# EAGLE design Power:Logic Board2 (EAGLE 7.6.0)
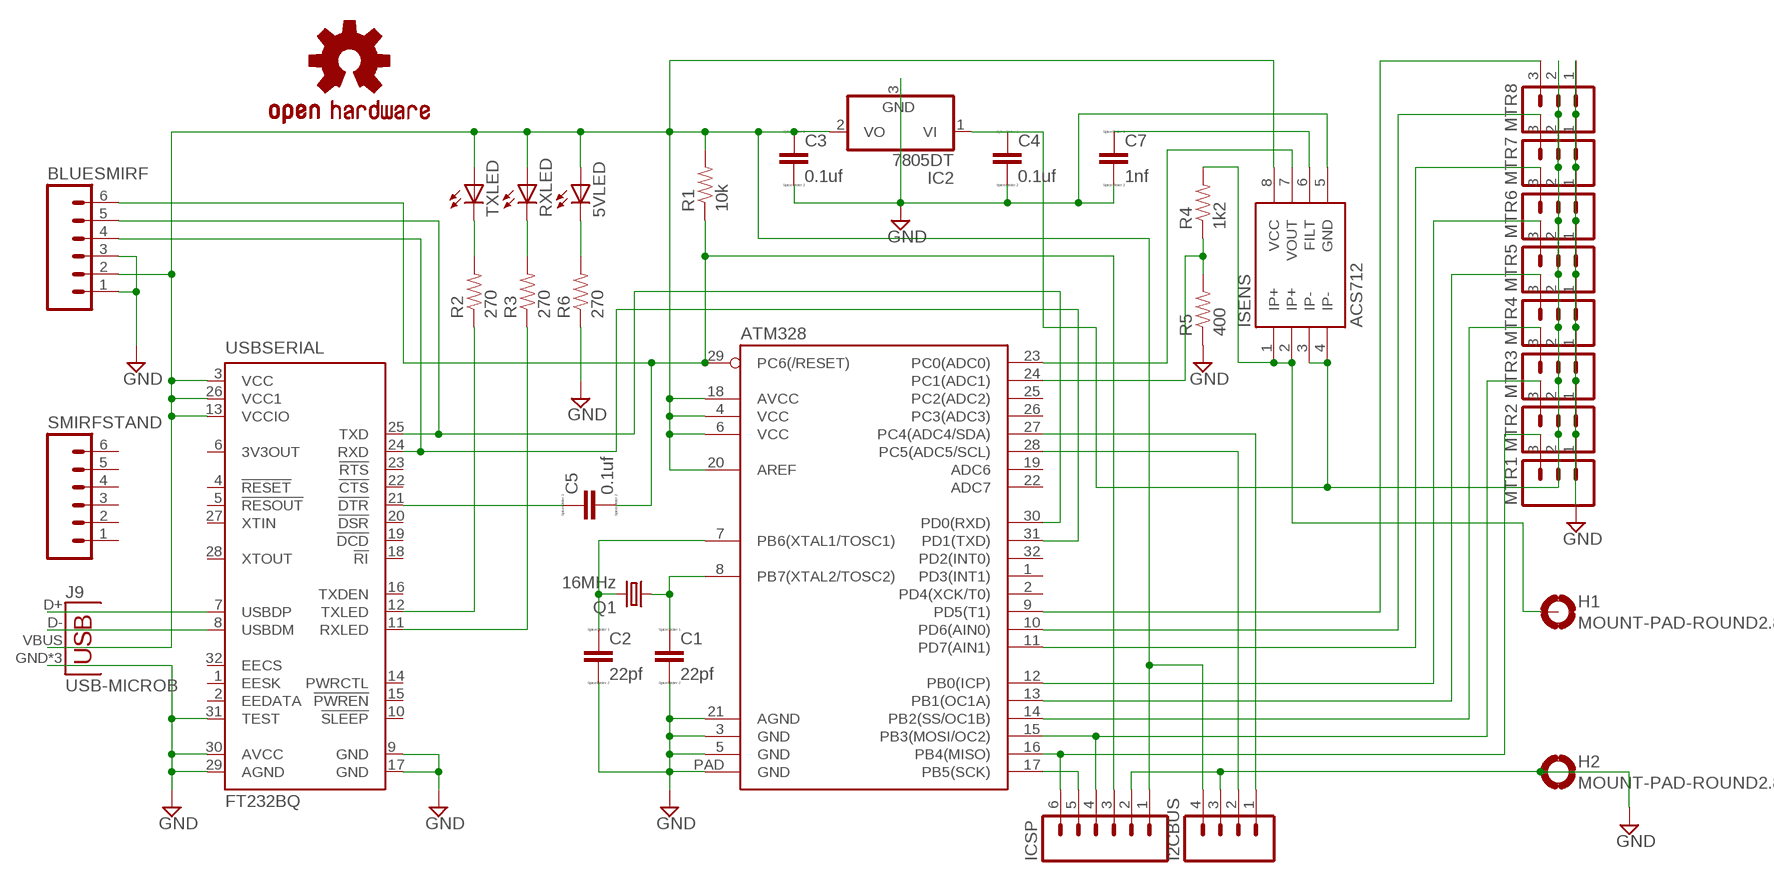
[diagram p0: schematic, sheet 1]

## Parts
5VLED  LEDCHIPLED_0805  [CHIPLED_0805]
ATM328  ATMEGA328P_MLFMLF32  [MLF32-PAD]
BLUESMIRF  M06NO_SILK_YES_STOP  [1X06_NO_SILK_YES_STOP]
C1  22pf  C  [C0805]
C2  22pf  C  [C0805]
C3  0.1uf  C  [C0805]
C4  0.1uf  C  [C0805]
C5  0.1uf  C  [C0805]
C7  1nf  C  [C0805]
H1  MOUNT-PAD-ROUND2.8  [2,8-PAD]
H2  MOUNT-PAD-ROUND2.8  [2,8-PAD]
I2CBUS  M04NO_SILK_ALL_ROUND  [1X04_NO_SILK_ALL_ROUND]
IC2  7805DT  [TO252]
ICSP  M06NO_SILK_YES_STOP  [1X06_NO_SILK_YES_STOP]
ISENS  ACS712  [SO08]
J9  USB-MICROB  [USB-MICROB]
LOGO1  OSHW-LOGOM  [OSHW-LOGO-M]
MTR1  M03PTH  [1X03]
MTR2  M03PTH  [1X03]
MTR3  M03PTH  [1X03]
MTR4  M03PTH  [1X03]
MTR5  M03PTH  [1X03]
MTR6  M03PTH  [1X03]
MTR7  M03PTH  [1X03]
MTR8  M03PTH  [1X03]
Q1  16MHz  CRYSTALHC49U-V  [HC49U-V]
R1  10k  RESISTOR0805-RES  [0805]
R2  270  RESISTOR0805-RES  [0805]
R3  270  RESISTOR0805-RES  [0805]
R4  1k2  RESISTOR0805-RES  [0805]
R5  400  RESISTOR0805-RES  [0805]
R6  270  RESISTOR0805-RES  [0805]
RXLED  LEDCHIPLED_0805  [CHIPLED_0805]
SMIRFSTAND  M06NO_SILK_YES_STOP  [1X06_NO_SILK_YES_STOP]
TXLED  LEDCHIPLED_0805  [CHIPLED_0805]
USBSERIAL  FT232BQ  [QFN32]

## Nets
GND: ATM328.3(GND) ATM328.5(GND) ATM328.21(AGND) ATM328.PAD(GND) BLUESMIRF.1 BLUESMIRF.3 C1.2 C2.2 C3.2 C4.2 C7.2 H2.B2,8(MOUNT) I2CBUS.3 IC2.3(GND) ICSP.2 ISENS.5(GND) J9.GND J9.MT1(GND) J9.MT2(GND) MTR1.1 MTR2.1 MTR3.1 MTR4.1 MTR5.1 MTR6.1 MTR7.1 MTR8.1 R5.1 R6.1 USBSERIAL.9(GND) USBSERIAL.17(GND) USBSERIAL.29(AGND) USBSERIAL.30(AVCC) USBSERIAL.31(TEST)
N$1: J9.D+ USBSERIAL.7(USBDP)
N$2: ATM328.31(PD1(TXD)) BLUESMIRF.4 USBSERIAL.24(RXD)
N$3: J9.D- USBSERIAL.8(USBDM)
N$4: 5VLED.A ATM328.4(VCC) ATM328.6(VCC) ATM328.18(AVCC) ATM328.20(AREF) BLUESMIRF.2 C3.1 I2CBUS.4 IC2.2(VO) ICSP.1 ISENS.8(VCC) J9.VBUS R1.2 RXLED.A TXLED.A USBSERIAL.3(VCC) USBSERIAL.13(VCCIO) USBSERIAL.26(VCC1)
N$5: ATM328.14(PB2(SS/OC1B)) MTR3.3
N$6: ATM328.23(PC0(ADC0)) ISENS.7(VOUT)
N$7: ATM328.8(PB7(XTAL2/TOSC2)) C1.1 Q1.1
N$8: ATM328.9(PD5(T1)) MTR8.3
N$9: ATM328.13(PB1(OC1A)) MTR4.3
N$10: ATM328.17(PB5(SCK)) ICSP.5
N$11: ATM328.12(PB0(ICP)) MTR5.3
N$12: ATM328.16(PB4(MISO)) ICSP.6 MTR1.3
N$13: ATM328.15(PB3(MOSI/OC2)) ICSP.4 MTR2.3
N$14: R2.2 TXLED.C
N$15: ATM328.7(PB6(XTAL1/TOSC1)) C2.1 Q1.2
N$16: R2.1 USBSERIAL.12(TXLED)
N$17: R3.2 RXLED.C
N$18: R3.1 USBSERIAL.11(RXLED)
N$19: ATM328.11(PD7(AIN1)) MTR6.3
N$20: ATM328.29(PC6(/RESET)) BLUESMIRF.6 C5.2 ICSP.3 R1.1
N$21: C7.1 ISENS.6(FILT)
N$22: C4.1 IC2.1(VI) ISENS.3(IP-) ISENS.4(IP-) MTR1.2 MTR2.2 MTR3.2 MTR4.2 MTR5.2 MTR6.2 MTR7.2 MTR8.2
N$23: ATM328.24(PC1(ADC1)) R4.1 R5.2
N$24: ATM328.10(PD6(AIN0)) MTR7.3
N$25: H1.B2,8(MOUNT) ISENS.1(IP+) ISENS.2(IP+) R4.2
N$26: ATM328.30(PD0(RXD)) BLUESMIRF.5 USBSERIAL.25(TXD)
N$27: C5.1 USBSERIAL.21(!DTR)
N$28: ATM328.28(PC5(ADC5/SCL)) I2CBUS.2
N$29: ATM328.27(PC4(ADC4/SDA)) I2CBUS.1
N$30: 5VLED.C R6.2
Unconnected: ATM328.1(PD3(INT1)) ATM328.2(PD4(XCK/T0)) ATM328.19(ADC6) ATM328.22(ADC7) ATM328.25(PC2(ADC2)) ATM328.26(PC3(ADC3)) ATM328.32(PD2(INT0)) SMIRFSTAND.1 SMIRFSTAND.2 SMIRFSTAND.3 SMIRFSTAND.4 SMIRFSTAND.5 SMIRFSTAND.6 USBSERIAL.1(EESK) USBSERIAL.2(EEDATA) USBSERIAL.4(!RESET) USBSERIAL.5(!RESOUT) USBSERIAL.6(3V3OUT) USBSERIAL.10(!SLEEP) USBSERIAL.14(PWRCTL) USBSERIAL.15(!PWREN) USBSERIAL.16(TXDEN) USBSERIAL.18(!RI) USBSERIAL.19(!DCD) USBSERIAL.20(!DSR) USBSERIAL.22(!CTS) USBSERIAL.23(!RTS) USBSERIAL.27(XTIN) USBSERIAL.28(XTOUT) USBSERIAL.32(EECS)

## Library data of the parts
5VLED RXLED TXLED = led:LED: LED OSRAM: - CHIPLED LG R971, LG N971, LY N971, LG Q971, LY Q971, LO R971, LY R971 LH N974, LH R974 LS Q976, LO Q976, LY Q976 LO Q996 - Hyper CHIPLED LW Q18S LB Q993, LB Q99A, LB R99A - SideLED LS A670, LO A670, LY A670, LG A670, LP A670 LB A673, LV A673, LT A673, LW A673 LH A674 LY A675 LS A676, LA A676, LO A676, LY A676, LW A676 LS A679, LY A679, LG A679 - Hyper Micro SIDELED® LS Y876, LA Y876, LO Y876, LY Y876 LT Y87S - SmartLED LW L88C, LW L88S LB L89C, LB L89S, LG L890 LS L89K, LO L89K, LY L89K LS L896, LA L896, LO L896, LY L896 - TOPLED LS T670, LO T670, LY T670, LG T670, LP T670 LSG T670, LSP T670, LSY T670, LOP T670, LYG T670 LG T671, LOG T671, LSG T671 LB T673, LV T673, LT T673, LW T673 LH T674 LS T676, LA T676, LO T676, LY T676, LB T676, LH T676, LSB T676, LW T676 LB T67C, LV T67C, LT T67C, LS T67K, LO T67K, LY T67K, LW E67C LS E67B, LA E67B, LO E67B, LY E67B, LB E67C, LV E67C, LT E67C LW T67C LS T679, LY T679, LG T679 LS T770, LO T770, LY T770, LG T770, LP T770 LB T773, LV T773, LT T773, LW T773 LH T774 LS E675, LA E675, LY E675, LS T675 LS T776, LA T776, LO T776, LY T776, LB T776 LHGB T686 LT T68C, LB T68C - Hyper Mini TOPLED® LB M676 - Mini TOPLED Santana® LG M470 LS M47K, LO M47K, LY M47K Source: http://www.osram.convergy.de LUXEON: - LUMILED® LXK2-PW12-R00, LXK2-PW12-S00, LXK2-PW14-U00, LXK2-PW14-V00 LXK2-PM12-R00, LXK2-PM12-S00, LXK2-PM14-U00 LXK2-PE12-Q00, LXK2-PE12-R00, LXK2-PE12-S00, LXK2-PE14-T00, LXK2-PE14-U00 LXK2-PB12-K00, LXK2-PB12-L00, LXK2-PB12-M00, LXK2-PB14-N00, LXK2-PB14-P00, LXK2-PB14-Q00 LXK2-PR12-L00, LXK2-PR12-M00, LXK2-PR14-Q00, LXK2-PR14-R00 LXK2-PD12-Q00, LXK2-PD12-R00, LXK2-PD12-S00 LXK2-PH12-R00, LXK2-PH12-S00 LXK2-PL12-P00, LXK2-PL12-Q00, LXK2-PL12-R00 Source: www.luxeon.com KINGBRIGHT: KA-3528ASYC Source: www.kingbright.com
ATM328 = SparkFun-DigitalIC:ATMEGA328P_MLF: 32-Pin Atmega328 part Commonly used on Arduino compatible boards Available in QFP and QFN packages TQFP is IC-09069 QFN is non-stock
BLUESMIRF ICSP SMIRFSTAND = SparkFun-Connectors:M06: Header 6 Standard 6-pin 0.1" header. Use with straight break away headers (SKU : PRT-00116), right angle break away headers (PRT-00553), swiss pins (PRT-00743), machine pins (PRT-00117), and female headers (PRT-00115). Molex polarized connector foot print use with SKU : PRT-08094 with associated crimp pins and housings. NOTES ON THE VARIANTS LOCK and LOCK_LONGPADS... This footprint was designed to help hold the alignment of a through-hole component (i.e. 6-pin header) while soldering it into place. You may notice that each hole has been shifted either up or down by 0.005 of an inch from it's more standard position (which is a perfectly straight line). This slight alteration caused the pins (the squares in the middle) to touch the edges of the holes. Because they are alternating, it causes a "brace" to hold the component in place. 0.005 has proven to be the perfect amount of "off-center" position when using our standard breakaway headers. Although looks a little odd when you look at the bare footprint, once you have a header in there, the alteration is very hard to notice. Also,if you push a header all the way into place, it is covered up entirely on the bottom side. This idea of altering the position of holes to aid alignment will be further integrated into the Sparkfun Library for other footprints. It can help hold any component with 3 or more connection pins.
C1-C5 C7 = eagle-ltspice:C: CAPACITOR, European symbol; SPICEMODEL: NONE; SPICEPREFIX: C
H1 H2 = holes:MOUNT-PAD-ROUND: MOUNTING PAD, round
I2CBUS = SparkFun-Connectors:M04: Header 4 Standard 4-pin 0.1" header. Use with straight break away headers (SKU : PRT-00116), right angle break away headers (PRT-00553), swiss pins (PRT-00743), machine pins (PRT-00117), and female headers (PRT-00115). Molex polarized connector foot print use with SKU : PRT-08231 with associated crimp pins and housings. 1MM SMD Version SKU: PRT-10208; PROD_ID: CONN-09696
IC2 = linear:78*: Positive VOLTAGE REGULATOR Source: http://cache.national.com/ds/LM/LM78L05.pdf http://www.fairchildsemi.com/ds/LM/LM7805.pdf
ISENS = SparkFun-AnalogIC:ACS712: Hall-effect-based isolated linear current sensor; PROD_ID: IC-08964
J9 = SparkFun-Connectors:USB: USB Connectors USB-B-PTH is fully proven SKU : PRT-00139/CONN-08278 USB-miniB is fully proven SKU : PRT-00587 USB-A-PCB is untested. USB-A-H is throughly reviewed, but untested. Spark Fun Electronics SKU : PRT-00437 USB-B-SMT is throughly reviewed, but untested. Needs silkscreen touching up. USB-A-S has not been used/tested USB-MB-H has not been used/tested USB-MICROB has been used. CONN-09505; PROD_ID: CONN-09505
LOGO1 = SparkFun-Aesthetics:OSHW-LOGO: Open Source Hardware Logo This logo indicates the piece of hardware it is found on incorporates a OSHW license and/or adheres to the definition of open source hardware found here: http://freedomdefined.org/OSHW
MTR1-MTR8 = SparkFun-Connectors:M03: Header 3 Standard 3-pin 0.1" header. Use with straight break away headers (SKU : PRT-00116), right angle break away headers (PRT-00553), swiss pins (PRT-00743), machine pins (PRT-00117), and female headers (PRT-00115). Molex polarized connector foot print use with SKU : PRT-08232 with associated crimp pins and housings.
Q1 = crystal:CRYSTAL: CRYSTAL; OC_FARNELL: 1666969; OC_NEWARK: unknown
R1-R6 = SparkFun-Passives:RESISTOR: Resistor Basic schematic elements and footprints for 0603, 1206, and PTH resistors.
USBSERIAL = ftdichip:FT232B: USB to serial UART interface Source: DS_FT232BL_BQ.pdf; OC_FARNELL: unknown; OC_NEWARK: unknown

## Board
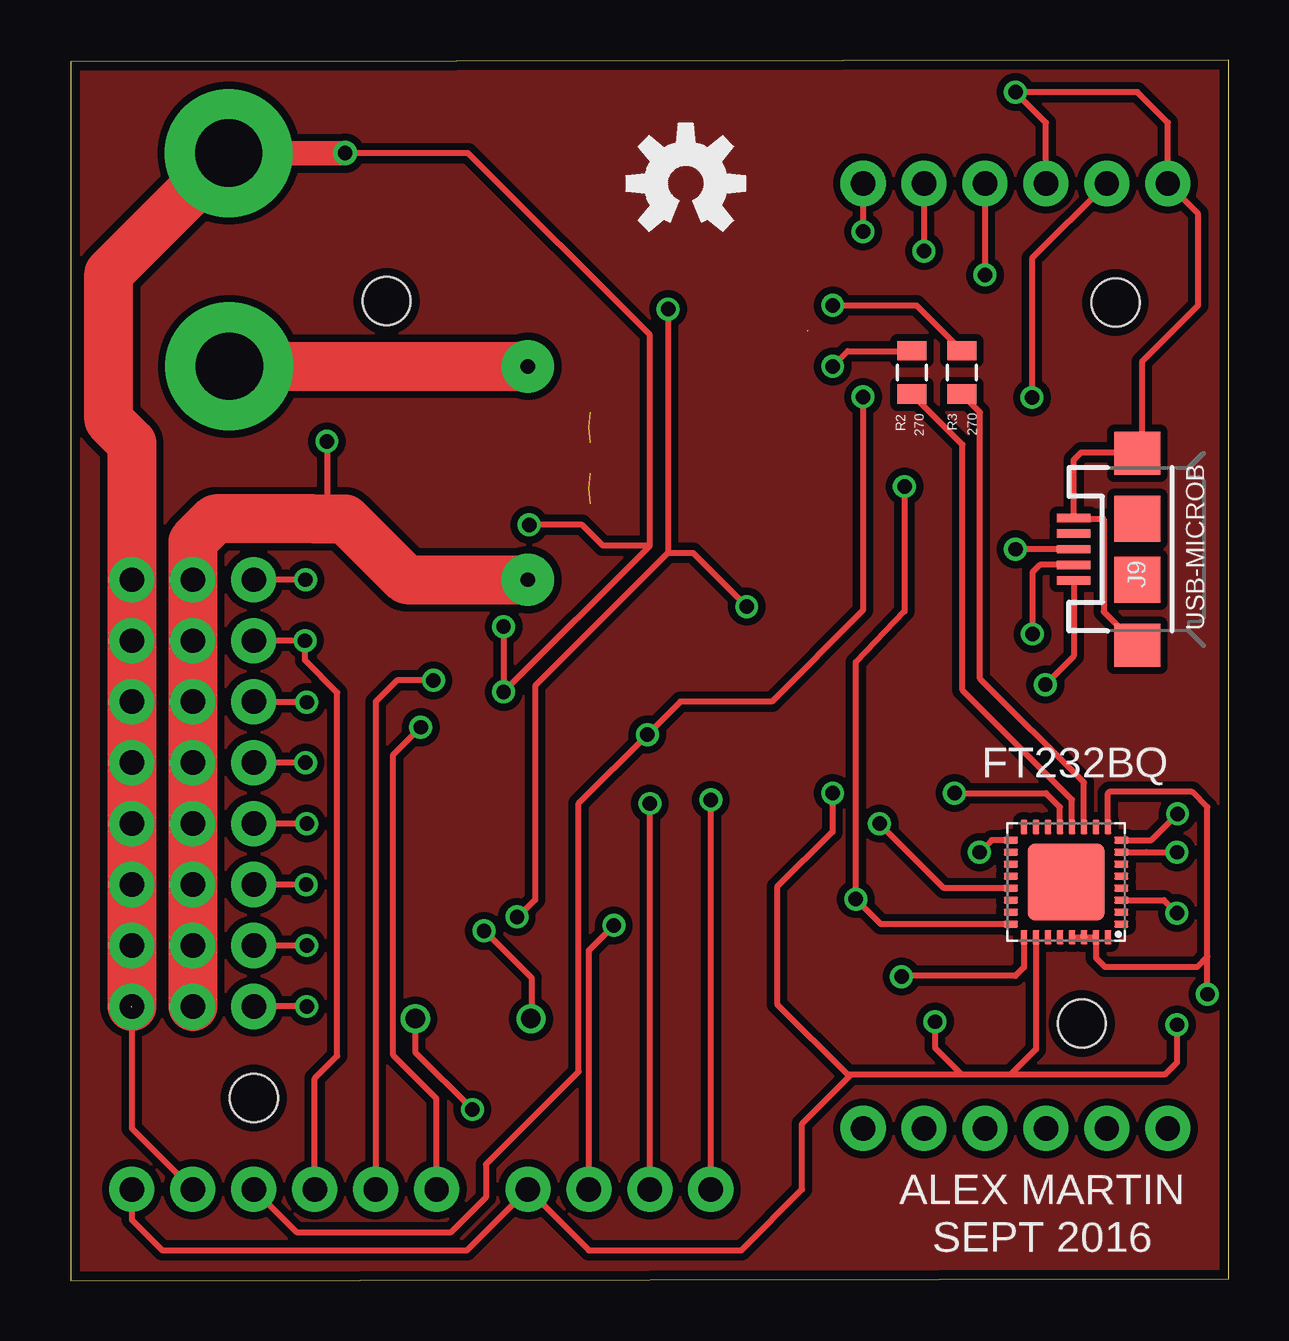
[diagram p1: board, top side]
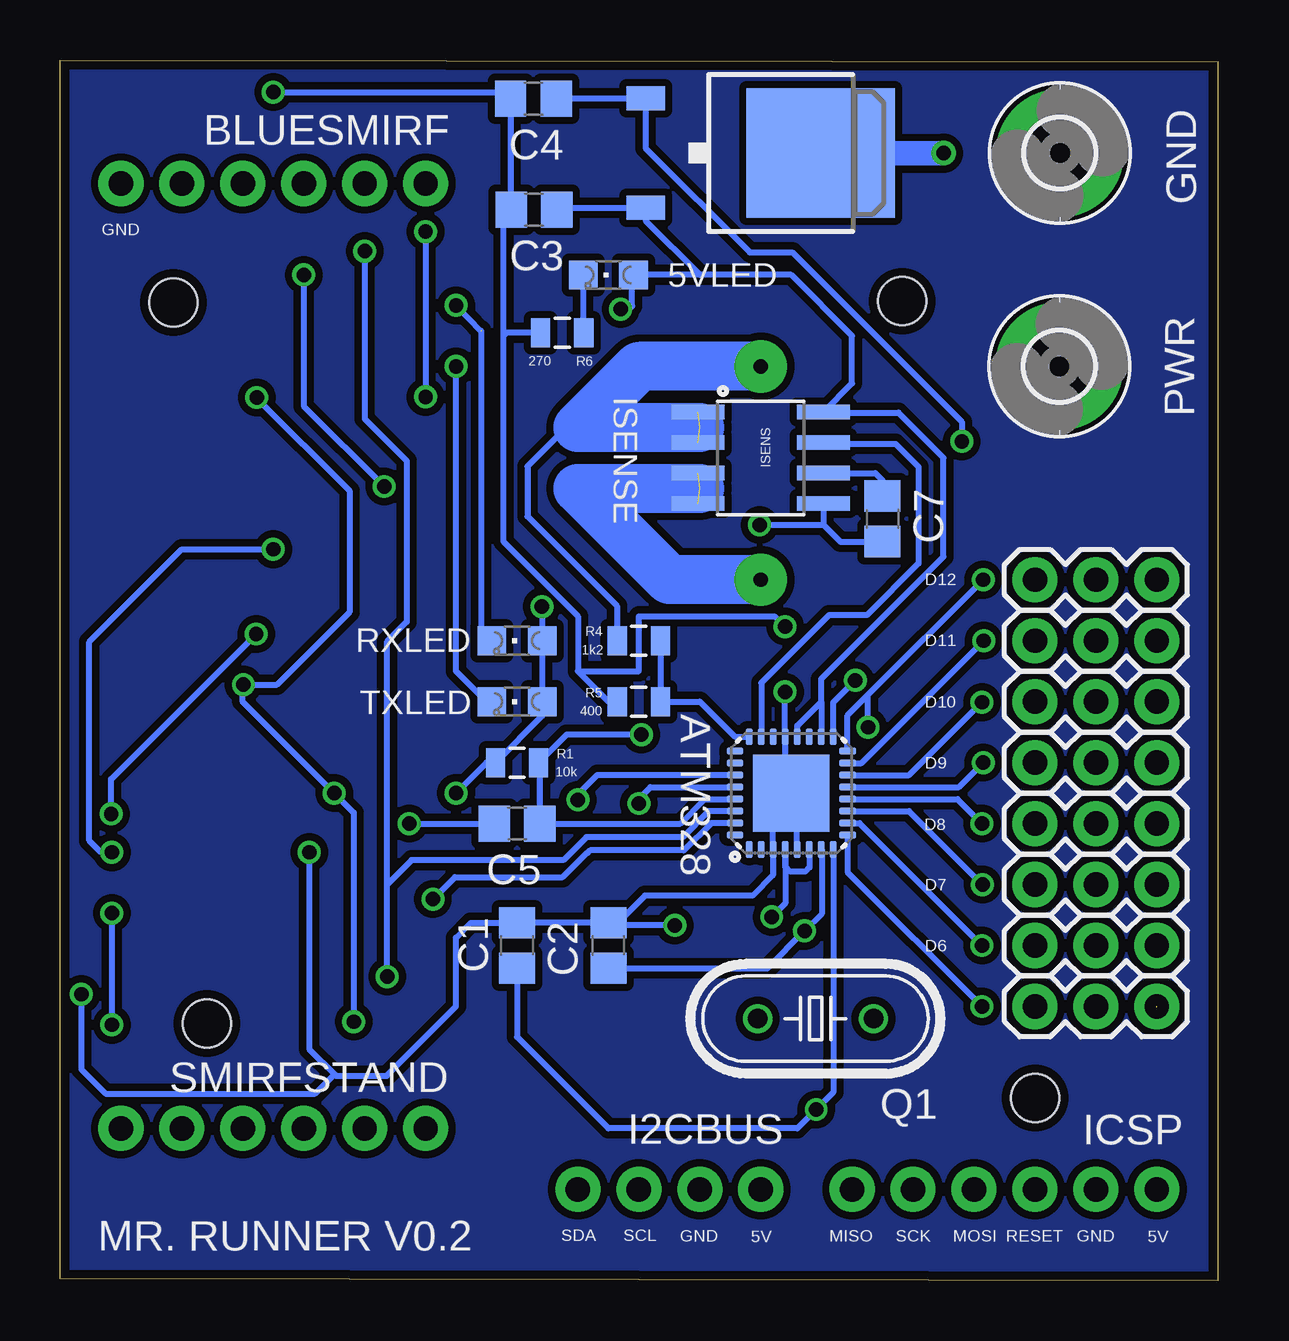
[diagram p2: board, bottom side, seen from below]

Size 48.26 x 50.87 mm. Coordinates in mm from the lower left corner, seen from the top.
Outline: 0,0 48.26,0.08 48.26,50.87 0,50.79 0,0
Copper layers (1*16): Top 0.0356mm / dielectric 1.5011mm / Bottom 0.0356mm
Design rules "oshpark-2layer": minimum track width 6mil, minimum drill 13mil, track to track 6mil, track to pad 6mil, pad to pad 6mil, via to via 6mil, smd to smd 6mil, copper to edge 15mil, drill to drill 6mil, minimum pad ring 7mil, minimum via ring 7mil, stop-mask expansion 2.5mil, vias tented up to drill 0mil, thermal gap 10mil
Holes 2 mm at 43.54,40.77 42.14,10.72 7.62,7.62 13.16,40.82

### Footprints (pad centres in the part's own frame; a part is rotated, then mirrored left to right if it is on the bottom)
CHIPLED_0805 = smd 1.2 x 1.2: A 0,-1.05; C 0,1.05
MLF32-PAD = smd 0.7 x 0.3: 1 -2.35,1.75; 2 -2.35,1.25; 3 -2.35,0.75; 4 -2.35,0.25; 5 -2.35,-0.25; 6 -2.35,-0.75; 7 -2.35,-1.25; 8 -2.35,-1.75; 17 2.35,-1.75; 18 2.35,-1.25; 19 2.35,-0.75; 20 2.35,-0.25; 21 2.35,0.25; 22 2.35,0.75; 23 2.35,1.25; 24 2.35,1.75 | smd 0.3 x 0.7: 9 -1.75,-2.35; 10 -1.25,-2.35; 11 -0.75,-2.35; 12 -0.25,-2.35; 13 0.25,-2.35; 14 0.75,-2.35; 15 1.25,-2.35; 16 1.75,-2.35; 25 1.75,2.35; 26 1.25,2.35; 27 0.75,2.35; 28 0.25,2.35; 29 -0.25,2.35; 30 -0.75,2.35; 31 -1.25,2.35; 32 -1.75,2.35 | smd 3.2 x 3.2: PAD 0,0
1X06_NO_SILK_YES_STOP = drill 1.016 pad 1.88: 1 0,0; 2 2.54,0; 3 5.08,0; 4 7.62,0; 5 10.16,0; 6 12.7,0
C0805 = smd 1.3 x 1.5: 1 -0.95,0; 2 0.95,0
2,8-PAD = drill 2.8 pad 5.334: B2,8 0,0
1X04_NO_SILK_ALL_ROUND = drill 1.016 pad 1.88: 1 0,0; 2 2.54,0; 3 5.08,0; 4 7.62,0
TO252 = smd 1 x 1.6: 1 -2.28,-4.8; 2 2.28,-4.8 | smd 5.4 x 6.2: 3 0,2.5
SO08 = smd 0.61 x 2.21: 1 -1.905,-2.616; 2 -0.635,-2.616; 3 0.635,-2.616; 4 1.905,-2.616; 5 1.905,2.616; 6 0.635,2.616; 7 -0.635,2.616; 8 -1.905,2.616
USB-MICROB = smd 0.35 x 1.4: D+ 0,2.65; D- -0.65,2.65; GND 1.3,2.65; ID 0.65,2.65; VBUS -1.3,2.65 | smd 1.8 x 1.9: MT1 -4,0; MT2 4,0 | smd 1.9 x 1.9: P$1 -1.27,0; P$2 1.27,0
1X03 = drill 1.016 pad 1.88: 1 0,0; 2 2.54,0; 3 5.08,0
HC49U-V = drill 0.813: 1 -2.413,0; 2 2.413,0
0805 = smd 0.8 x 1.2: 1 -0.9,0; 2 0.9,0
QFN32 = smd 0.6 x 0.3: 1 -2.3,1.75; 2 -2.3,1.25; 3 -2.3,0.75; 4 -2.3,0.25; 5 -2.3,-0.25; 6 -2.3,-0.75; 7 -2.3,-1.25; 8 -2.3,-1.75; 17 2.3,-1.75; 18 2.3,-1.25; 19 2.3,-0.75; 20 2.3,-0.25; 21 2.3,0.25; 22 2.3,0.75; 23 2.3,1.25; 24 2.3,1.75 | smd 0.3 x 0.6: 9 -1.75,-2.3; 10 -1.25,-2.3; 11 -0.75,-2.3; 12 -0.25,-2.3; 13 0.25,-2.3; 14 0.75,-2.3; 15 1.25,-2.3; 16 1.75,-2.3; 25 1.75,2.3; 26 1.25,2.3; 27 0.75,2.3; 28 0.25,2.3; 29 -0.25,2.3; 30 -0.75,2.3; 31 -1.25,2.3; 32 -1.75,2.3 | smd 3.2 x 3.2: EXP 0,0

### Placement (x,y rotation side)
5VLED  25.4,41.91 90 bottom
ATM328  17.78,20.32 90 bottom
BLUESMIRF  45.72,45.72 180 top
C1  29.21,13.97 90 bottom
C2  25.4,13.97 90 bottom
C3  28.5,44.63 180 bottom
C4  28.52,49.25 180 bottom
C5  29.21,19.05 0 bottom
C7  13.97,31.75 270 bottom
H1  6.6,38.1 0 bottom
H2  6.58,46.99 0 bottom
I2CBUS  26.67,3.81 180 top
IC2  19.05,46.99 270 bottom
ICSP  2.54,3.81 0 top
ISENS  19.05,34.29 270 bottom
J9  44.45,30.48 90 top
LOGO1  25.63,45.72 0 top
MTR1  2.54,29.21 180 bottom
MTR2  2.54,26.67 180 bottom
MTR3  2.54,24.13 180 bottom
MTR4  2.54,21.59 180 bottom
MTR5  2.54,19.05 180 bottom
MTR6  2.54,16.51 180 bottom
MTR7  2.54,13.97 180 bottom
MTR8  2.54,11.43 180 bottom
Q1  16.76,10.92 180 bottom
R1  29.21,21.59 180 bottom
R2  35.05,37.85 90 top
R3  37.13,37.85 90 top
R4  24.13,26.67 180 bottom
R5  24.13,24.13 0 bottom
R6  27.33,39.5 0 bottom
RXLED  29.21,26.67 90 bottom
SMIRFSTAND  33.02,6.35 0 top
TXLED  29.21,24.13 90 bottom
USBSERIAL  41.48,16.61 180 top

### Tracks (layer width: path | path; a pad name or v marks a point on that pad's centre or on a via)
GND  (via drill 0.6, 0.6 pad 1.02)  (1 unrouted)
  Top 0.254: 24.13,30.63 v18.03,24.54 v18.03,27.25 | 24.13,30.63 22.17,30.63 21.31,31.5 v19.1,31.5 | v22.63,14.81 21.59,13.77 I2CBUS.3 | USBSERIAL.9 43.23,20.32 43.28,20.37 46.74,20.37 47.37,19.74 47.37,13.51 | USBSERIAL.29 USBSERIAL.30 USBSERIAL.31 | USBSERIAL.17 38.38,18.36 v37.87,17.86 | USBSERIAL.31 | v11.43,46.99 IC2.3 24.13,39.41 24.13,30.63 | BLUESMIRF.3 40.64,48.26 v39.37,49.53 44.45,49.53 45.72,48.26 BLUESMIRF.1 46.99,44.45 46.99,40.64 44.64,38.29 44.64,34.67 J9.MT2 44.41,34.52 42.11,34.52 41.8,34.21 J9.GND 41.83,31.75 43.03,31.75 43.05,31.72 43.05,27.88 J9.MT1 | ICSP.2 2.54,6.35 2.54,11.4 | v47.37,11.94 47.37,13.51 | USBSERIAL.31 42.73,13.46 43.1,13.08 46.94,13.08 47.37,13.51
  Top 1.016: H2.B2,8 v11.43,46.99
  Top 2.032: MTR8.1 MTR7.1 MTR6.1 MTR5.1 MTR4.1 MTR3.1 MTR2.1 MTR1.1 2.54,34.9 1.57,35.87 1.57,41.99 H2.B2,8
  Bottom 0.254: C2.2 C1.2 31.14,14.91 31.75,14.3 31.75,11.43 34.65,8.53 36.75,8.53 36.82,8.6 | ISENS.5 16.43,31.5 | 16.43,31.5 15.72,30.79 13.98,30.79 C7.2 | ATM328.5 17.55,17.99 17.55,19.05 17.78,19.28 17.78,19.53 | C2.2 25.01,14.92 23.88,16.05 19.38,16.05 18.54,16.89 18.54,17.96 ATM328.3 18.54,17.98 18.54,18.77 17.78,19.53 | v18.03,24.54 ATM328.21 18.03,21.61 18.01,21.59 17.78,21.59 ATM328.PAD 17.78,19.53 | R5.1 25.4,24.13 26.67,25.4 | 29.77,39.37 29.77,30.79 26.67,27.69 26.67,25.4 | 29.77,39.37 29.77,44.31 C3.2 29.47,44.65 C4.2 29.75,49.53 v39.37,49.53 | R6.1 29.64,39.5 29.77,39.37 | v19.1,31.5 16.43,31.5 | v22.63,14.81 25.29,14.81 C2.2 | v37.87,17.86 37.87,9.65 36.82,8.6 | 26.67,25.4 24.13,25.4 24.13,27.69 18.47,27.69 v18.03,27.25 | v47.37,11.94 47.37,8.81 46.35,7.8 37.62,7.8 36.82,8.6
  Bottom 1.016: IC2.3 v11.43,46.99
N$1  (via drill 0.6)
  Top 0.254: USBSERIAL.7 44.83,17.86 v46.1,17.86 | J9.D+ v39.37,30.48
  Bottom 0.254: v46.1,17.86 46.56,17.86 47.04,18.34 47.04,26.62 43.18,30.48 v39.37,30.48
N$2  (via drill 0.6)
  Top 0.254: v34.75,33.1 34.75,27.89 32.72,25.78 v32.72,15.9 33.75,14.86 USBSERIAL.24 | BLUESMIRF.4 v38.1,41.91
  Bottom 0.254: ATM328.31 21.11,19.07 22.25,17.93 26.16,17.93 26.26,17.83 26.29,17.83 27.3,16.81 31.8,16.81 v32.72,15.9 | v38.1,41.91 38.1,36.45 v34.75,33.1
N$3  (via drill 0.6)
  Top 0.254: USBSERIAL.8 45.03,18.36 v46.13,19.46 | J9.D- 40.4,29.83 40.08,29.51 v40.08,26.95
  Bottom 0.254: 40.08,26.92 v40.08,26.95 46.13,20.9 v46.13,19.46
N$4  (via drill 0.6)
  Top 0.254: v18.59,15.16 18.64,15.16 19.36,15.88 19.36,24.79 24.89,30.33 | v31.75,20.32 31.75,18.69 31.73,18.69 29.44,16.41 29.44,11.53 32.38,8.58 32.51,8.58 | USBSERIAL.26 40.23,9.65 39.17,8.58 | 39.17,8.58 37.13,8.58 | 37.13,8.58 32.51,8.58 | v40.62,24.84 41.8,26.03 J9.VBUS | v36.02,10.79 36.02,9.7 37.13,8.58 | v24.89,40.49 24.89,30.33 | 24.89,30.33 25.93,30.33 v28.17,28.09 | USBSERIAL.13 41.23,19.73 40.64,20.32 v36.83,20.32 | ICSP.1 2.54,2.54 3.81,1.27 16.51,1.27 I2CBUS.4 21.59,1.27 27.94,1.27 30.48,3.81 30.48,6.55 32.51,8.58 | BLUESMIRF.2 40.06,42.6 v40.06,36.8 | USBSERIAL.3 45.56,15.86 v46.1,15.32 | v46.1,10.67 46.1,9.09 45.59,8.58 39.17,8.58
  Bottom 0.254: C3.1 27.47,44.71 IC2.2 23.85,44.17 21.59,41.91 | 16.53,24.13 ATM328.18 | ATM328.20 17.53,23.13 16.53,24.13 | ATM328.6 17.02,17.96 17.02,17.22 17.2,17.04 17.83,17.04 18.03,17.24 ATM328.4 18.03,15.73 v18.59,15.16 | v31.75,20.32 30.48,21.59 R1.2 28.16,23.54 TXLED.A RXLED.A v28.17,28.09 | v36.02,10.79 36.02,19.51 v36.83,20.32 40.66,24.15 40.66,24.79 v40.62,24.84 39.22,24.84 36.2,27.86 36.2,32.92 40.06,36.78 v40.06,36.8 | v24.89,40.49 24.54,40.49 24.41,40.62 24.41,41.85 5VLED.A 21.59,41.91 | 21.59,41.91 17.78,41.91 15.24,39.37 15.24,37.39 ISENS.8 16.41,36.17 13.31,36.17 11.43,34.29 11.43,30.18 16.54,25.07 16.54,24.13 16.53,24.13 | v46.1,15.32 v46.1,10.67
N$5  (via drill 0.6)
  Top 0.254: v9.83,24.11 7.64,24.11 MTR3.3
  Bottom 0.254: ATM328.14 12.86,21.07 v9.83,24.11
N$6
  Bottom 0.254: ISENS.7 16.38,34.87 13.44,34.87 12.47,33.91 12.47,29.9 14.63,27.74 16.2,27.74 19.03,24.91 ATM328.23
N$7  (via drill 0.6)
  Top 0.254: Q1.1 14.35,9.52 v16.74,7.14
  Bottom 0.254: C1.1 29.21,10.16 25.4,6.35 17.53,6.35 v16.74,7.14 16.03,7.85 ATM328.8
N$8  (via drill 0.6)
  Top 0.254: v9.83,11.43 MTR8.3
  Bottom 0.254: ATM328.9 15.43,17.03 v9.83,11.43
N$9  (via drill 0.6)
  Top 0.254: v9.78,21.59 MTR4.3
  Bottom 0.254: ATM328.13 10.8,20.57 v9.78,21.59
N$10  (via drill 0.6)
  Top 0.254: v15.11,25.02 13.59,25.02 12.7,24.13 ICSP.5
  Bottom 0.254: ATM328.17 16.03,24.1 v15.11,25.02
N$11  (via drill 0.6)
  Top 0.254: v9.83,19.05 MTR5.3
  Bottom 0.254: ATM328.12 10.85,20.07 v9.83,19.05
N$12  (via drill 0.6)
  Top 0.254: 9.8,29.18 v9.78,29.21 MTR1.3 | v14.58,23.06 13.44,21.92 13.44,9.4 15.24,7.59 ICSP.6
  Bottom 0.254: ATM328.16 15.43,23.56 14.58,24.41 | 14.58,24.41 v9.78,29.21 | v14.58,23.06 14.58,24.41
N$13  (via drill 0.6)
  Top 0.254: MTR2.3 v9.75,26.67 9.75,25.86 11.1,24.51 11.1,9.37 10.16,8.43 ICSP.4
  Bottom 0.254: ATM328.15 14.85,21.57 v9.75,26.67
N$14  (via drill 0.6)
  Top 0.254: v31.75,38.1 32.38,38.73 35.04,38.73 R2.2
  Bottom 0.254: TXLED.C 30.48,24.13 31.75,25.4 v31.75,38.1
N$15  (via drill 0.6)
  Top 0.254: v17.22,14.58 17.25,14.58 19.2,12.62 19.2,10.95 Q1.2
  Bottom 0.254: ATM328.7 16.51,17.95 16.51,15.29 v17.22,14.58 18.78,13.02 C2.1
N$16
  Top 0.254: USBSERIAL.12 41.73,20.04 37.16,24.61 37.16,34.84 R2.1
N$17  (via drill 0.6)  (1 unrouted)
  Top 0.254: v31.75,40.64 35.24,40.64 R3.2
  Bottom 0.254: RXLED.C 30.71,27.12 30.71,39.6 | v31.75,40.64 30.71,39.57
N$18
  Top 0.254: 37.15,36.93 R3.1 37.9,36.18 37.9,25.1 42.23,20.76 USBSERIAL.11
N$19  (via drill 0.6)
  Top 0.254: v9.8,16.51 MTR6.3
  Bottom 0.254: ATM328.11 12.86,19.57 v9.8,16.51
N$20  (via drill 0.6)
  Top 0.254: v33.02,36.83 33.02,27.94 29.21,24.13 25.4,24.13 v24.03,22.76 21.16,19.89 21.16,8.71 17.3,4.85 17.3,3.48 15.85,2.03 9.4,2.03 ICSP.3 | BLUESMIRF.6 v33.02,43.71
  Bottom 0.254: ATM328.29 21.39,20.07 22.4,19.05 C5.2 28.26,21.54 R1.1 27.14,22.76 v24.03,22.76 | v33.02,43.71 v33.02,36.83
N$21
  Bottom 0.254: ISENS.6 14.28,33.66 13.97,33.35 C7.1
N$22  (via drill 0.6, 0.6 pad 2.18)  (2 unrouted)
  Top 0.254: v10.67,34.98 10.67,32.26 10.16,31.75
  Top 2.032: MTR8.2 MTR7.2 MTR6.2 MTR5.2 MTR4.2 MTR3.2 MTR2.2 MTR1.2 5.08,30.81 6.02,31.75 10.16,31.75 11.43,31.75 13.97,29.21 v19.05,29.21
  Bottom 0.254: C4.1 27.55,49.27 IC2.1 23.85,47.19 19.51,42.85 17.73,42.85 10.67,35.79 v10.67,34.98
  Bottom 2.032: 21.59,33.02 26.67,33.02 22.86,29.21 v19.05,29.21
N$23
  Bottom 0.254: R4.1 R5.2 21.59,24.13 20.13,22.67 ATM328.24
N$24  (via drill 0.6)
  Top 0.254: v9.83,13.97 MTR7.3
  Bottom 0.254: ATM328.10 14.93,19.07 v9.83,13.97
N$25  (via drill 0.6 pad 2.18)  (2 unrouted)
  Top 2.032: H1.B2,8 v19.05,38.1
  Bottom 0.254: 26.67,35.56 27.15,35.56 28.78,33.93 28.78,31.85 25.04,28.12 25.04,26.68 R4.2
  Bottom 2.032: 21.59,35.56 26.67,35.56 24.13,38.1 v19.05,38.1
N$26  (via drill 0.6)
  Top 0.254: USBSERIAL.25 39.73,13.06 39.37,12.7 34.65,12.7 v34.62,12.68 | BLUESMIRF.5 v35.56,42.9
  Bottom 0.254: ATM328.30 21.22,19.57 22.3,18.49 26.31,18.49 27.28,17.53 33.6,17.53 34.62,16.51 | v34.62,12.68 34.62,16.51 | v35.56,42.9 35.56,35.92 33.81,34.16 33.81,27.46 34.62,26.64 34.62,16.51
N$27  (via drill 0.6)
  Top 0.254: USBSERIAL.21 36.39,16.36 v33.71,19.05
  Bottom 0.254: 30.18,19.07 C5.1 v33.71,19.05
N$28  (via drill 0.6)
  Top 0.254: I2CBUS.2 v24.13,19.89
  Bottom 0.254: v24.13,19.89 24.13,20.09 23.65,20.57 ATM328.28
N$29  (via drill 0.6)
  Top 0.254: I2CBUS.1 v26.67,20.04
  Bottom 0.254: v26.67,20.04 26.67,20.27 25.86,21.08 20.14,21.08 ATM328.27
N$30
  Bottom 0.254: 5VLED.C 26.45,39.52 R6.2
N$42
  pour Bottom (isolate 0.305): 0,50.8 0,0 48.26,0 48.26,50.8
N$43
  pour Top (isolate 0.305): 0,50.8 0,0 48.26,0 48.26,50.8

### Text on the board
tNames: ALEX MARTIN | SEPT 2016
bNames: GND | GND | PWR | ISENSE | D12 | D11 | D10 | D9 | D8 | D7 | D6 | 5V | GND | RESET | MOSI | SCK | MISO | 5V | GND | SCL | SDA | MR. RUNNER V0.2